# EAGLE schematic OLED_Adapter_ein_Display2 (EAGLE 9.5.2)
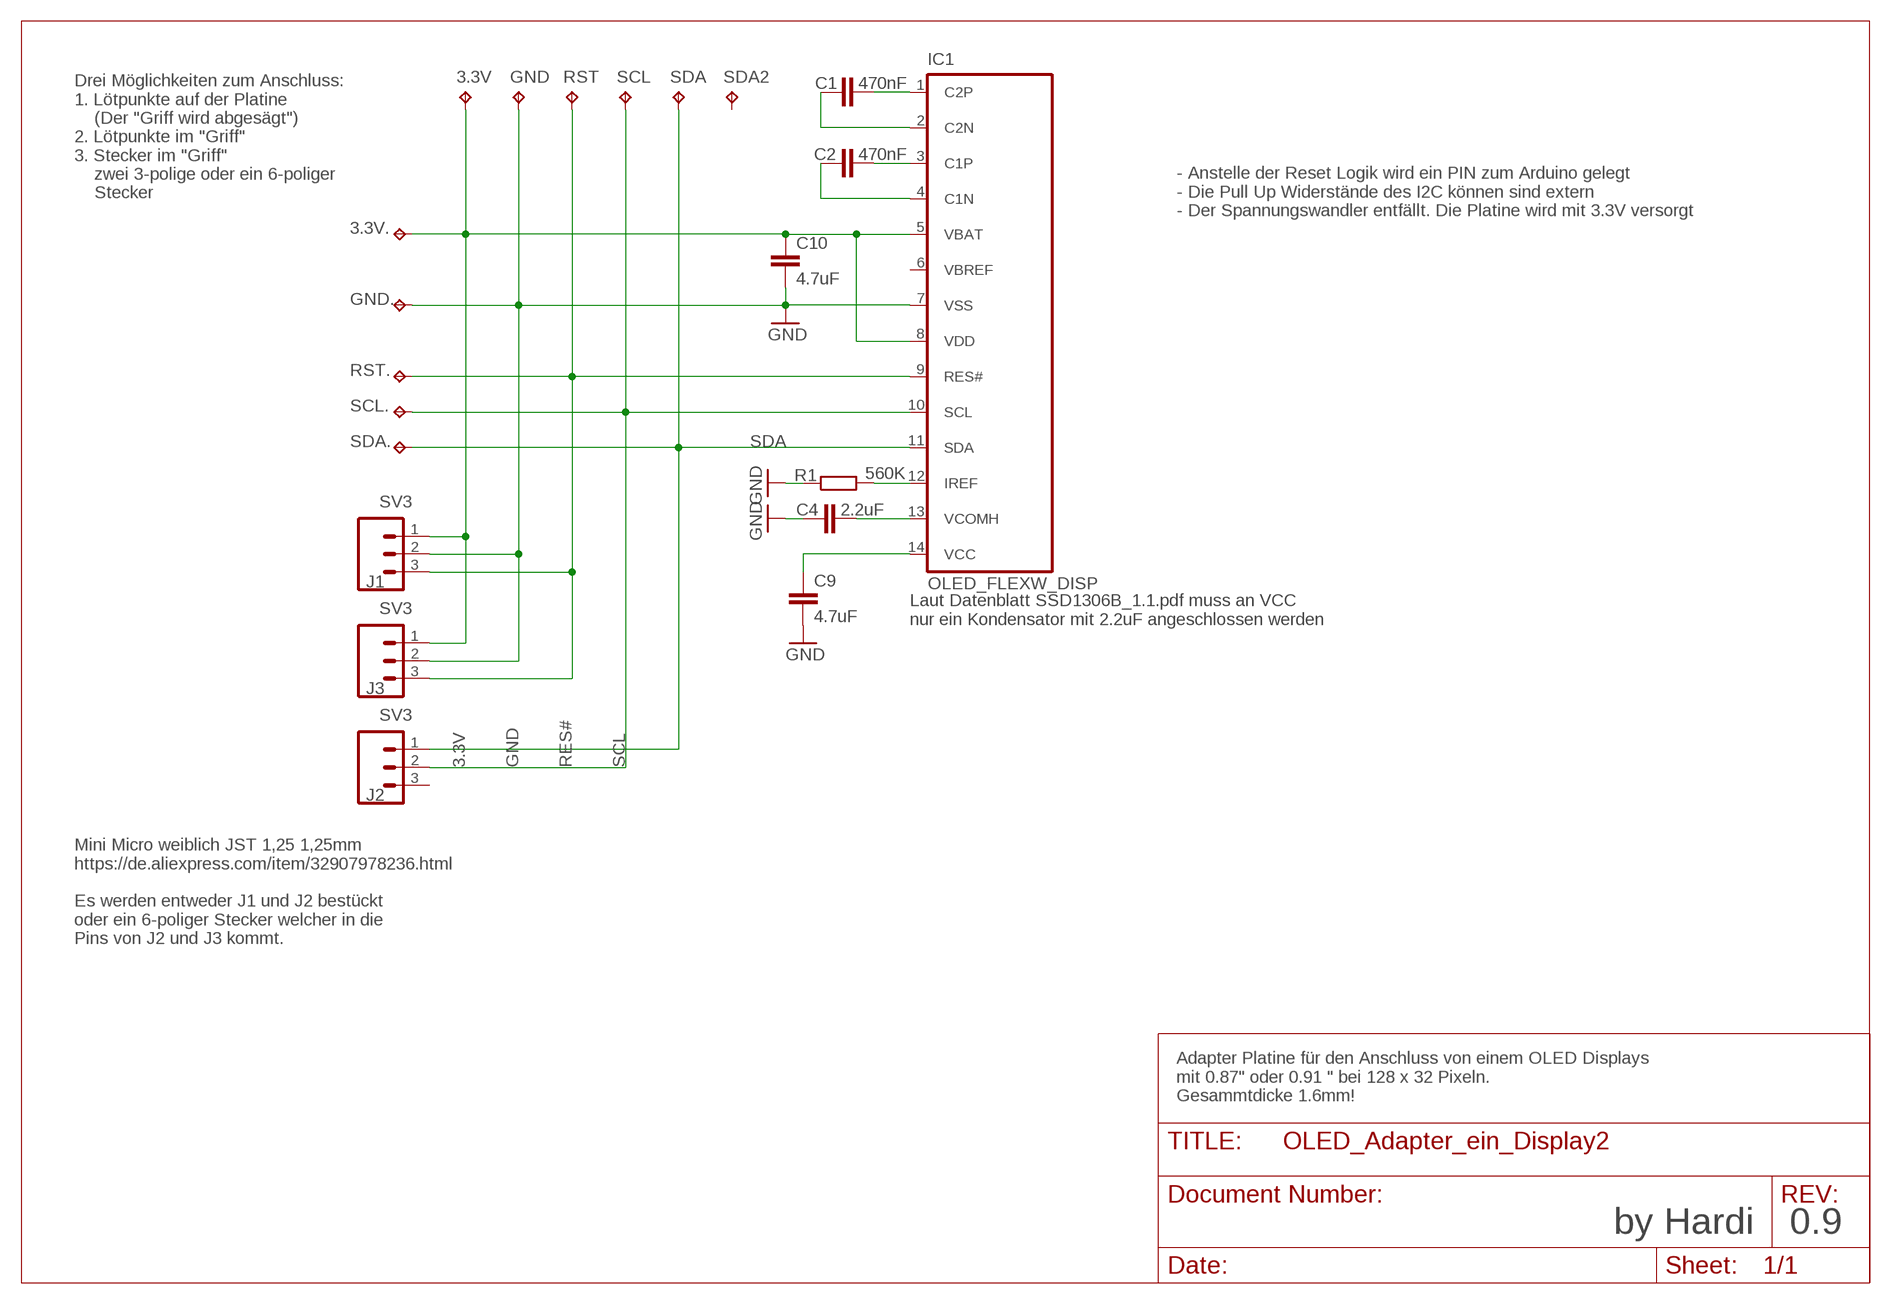
[diagram p0: schematic, sheet 1]

## Parts
3.3V  3.3V  TPTP16SQ  [TP16SQ]
3.3V.  TPTP16SQ  [TP16SQ]
C1  470nF  C-EUC0603  [C0603]
C2  470nF  C-EUC0603  [C0603]
C4  2.2uF  C-EUC0603  [C0603]
C9  4.7uF  C-EUC0603  [C0603]
C10  4.7uF  C-EUC0603  [C0603]
GND  GND  TPTP16R  [TP16R]
GND.  TPTP16R  [TP16R]
IC1  OLED_FLEXW_DISP  [OLED_FLEX_W_DISP]
J1  SV3  M03  [MINI]
J2  SV3  M03  [MINI]
J3  SV3  M03  [MINI]
R1  560K  R-EU_R0603  [R0603]
RST  RST  TPTP16R  [TP16R]
RST.  TPTP16R  [TP16R]
SCL  SCL  TPTP16R  [TP16R]
SCL.  TPTP16R  [TP16R]
SDA  SDA  TPTP16R  [TP16R]
SDA2  SDA2  TPTP16R  [TP16R]
SDA.  TPTP16R  [TP16R]

## Nets
3.3V: 3.3V..TP 3.3V.TP C10.1 IC1.5(VBAT) IC1.8(VDD) J1.1 J3.1
GND: C4.1 C9.2 C10.2 GND..TP GND.TP IC1.7(VSS) J1.2 J3.2 R1.1
N$1: IC1.12(IREF) R1.2
N$3: C1.2 IC1.1(C2P)
N$4: C1.1 IC1.2(C2N)
N$5: C2.2 IC1.3(C1P)
N$6: C2.1 IC1.4(C1N)
N$7: C9.1 IC1.14(VCC)
N$8: C4.2 IC1.13(VCOMH)
RES#: IC1.9(RES#) J1.3 J3.3 RST..TP RST.TP
SCL: IC1.10(SCL) J2.2 SCL..TP SCL.TP
SDA: IC1.11(SDA) J2.1 SDA..TP SDA.TP
Unconnected: IC1.6(VBREF) J2.3 SDA2.TP

## Notes on the sheet
- Drei Möglichkeiten zum Anschluss:
  1. Lötpunkte auf der Platine
      (Der "Griff wird abgesägt")
  2. Lötpunkte im "Griff"
  3. Stecker im "Griff"
      zwei 3-polige oder ein 6-poliger
      Stecker
- - Anstelle der Reset Logik wird ein PIN zum Arduino gelegt
  - Die Pull Up Widerstände des I2C können sind extern
  - Der Spannungswandler entfällt. Die Platine wird mit 3.3V versorgt
- Laut Datenblatt SSD1306B_1.1.pdf muss an VCC
  nur ein Kondensator mit 2.2uF angeschlossen werden
- Mini Micro weiblich JST 1,25 1,25mm
  https://de.aliexpress.com/item/32907978236.html
  
  Es werden entweder J1 und J2 bestückt
  oder ein 6-poliger Stecker welcher in die
  Pins von J2 und J3 kommt.
- Adapter Platine für den Anschluss von einem OLED Displays 
  mit 0.87" oder 0.91 " bei 128 x 32 Pixeln.
  Gesammtdicke 1.6mm!
- by Hardi | 0.9

## Library data of the parts
3.3V 3.3V. GND GND. RST RST. SCL SCL. SDA SDA2 SDA. = testpad:TP: Test pad
C1 C2 C4 C9 C10 = resistor:C-EU: CAPACITOR, European symbol
IC1 = OLED_Flex:OLED_FLEX: 14-Pin OLED Conector 0.91" or 0.86 " Source: https://www.buydisplay.com/white-0-87-inch-oled-display-panel-128x32-iic-i2c-ssd1316 ER-OLED0.87-1_Datasheet.pdf by Hardi
J1-J3 = SparkFun-Connectors:M03: Header 3 Standard 3-pin 0.1" header. Use with straight break away headers (SKU : PRT-00116), right angle break away headers (PRT-00553), swiss pins (PRT-00743), machine pins (PRT-00117), and female headers (PRT-00115). Molex polarized connector foot print use with SKU : PRT-08232 with associated crimp pins and housings.
R1 = rcl:R-EU_: RESISTOR, European symbol; SPICEPREFIX: R